# Altium project Y001_Artix7_USB3.0_D0.PrjPCB (part 2 of 2)

## Sheet POWER.SchDoc
size A3
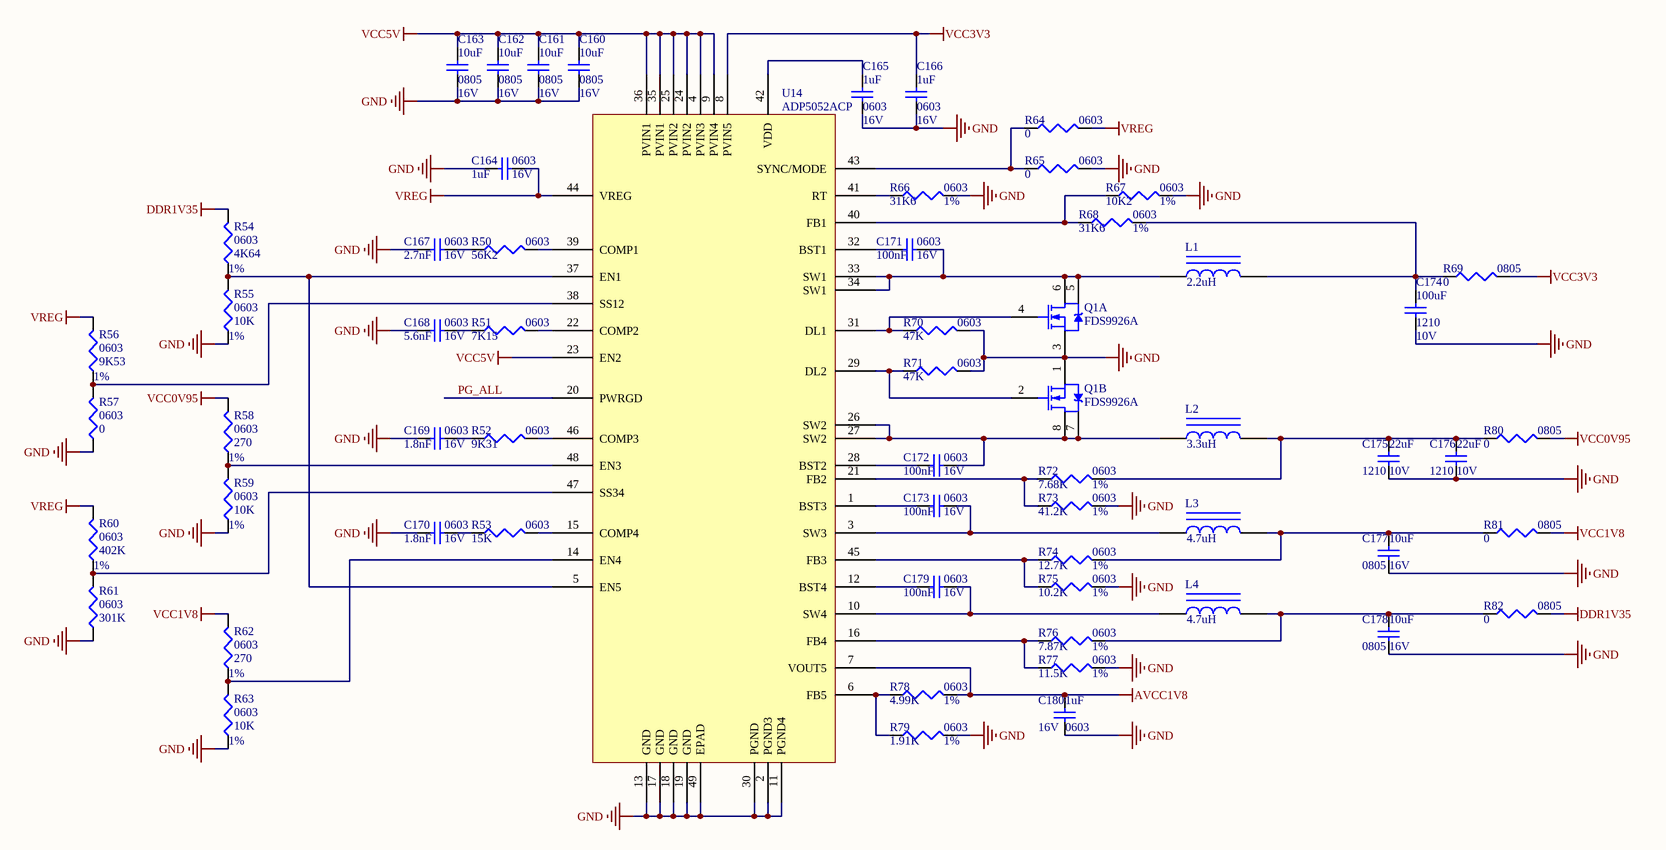
[diagram p7: POWER.SchDoc]

### Parts
C160  PackageReference: 0805  V: 16V  [2012[0805]]  (hidden comment: 10uF)
C161  PackageReference: 0805  V: 16V  [2012[0805]]  (hidden comment: 10uF)
C162  PackageReference: 0805  V: 16V  [2012[0805]]  (hidden comment: 10uF)
C163  PackageReference: 0805  V: 16V  [2012[0805]]  (hidden comment: 10uF)
C164  PackageReference: 0603  V: 16V  [1608[0603]]  (hidden comment: 1uF)
C165  PackageReference: 0603  V: 16V  [1608[0603]]  (hidden comment: 1uF)
C166  PackageReference: 0603  V: 16V  [1608[0603]]  (hidden comment: 1uF)
C167  PackageReference: 0603  V: 16V  [1608[0603]]  (hidden comment: 2.7nF)
C168  PackageReference: 0603  V: 16V  [1608[0603]]  (hidden comment: 5.6nF)
C169  PackageReference: 0603  V: 16V  [1608[0603]]  (hidden comment: 1.8nF)
C170  PackageReference: 0603  V: 16V  [1608[0603]]  (hidden comment: 1.8nF)
C171  PackageReference: 0603  V: 16V  [1608[0603]]  (hidden comment: 100nF)
C172  PackageReference: 0603  V: 16V  [1608[0603]]  (hidden comment: 100nF)
C173  PackageReference: 0603  V: 16V  [1608[0603]]  (hidden comment: 100nF)
C174  PackageReference: 1210  V: 10V  [2012[0805]]  (hidden comment: 100uF)
C175  PackageReference: 1210  V: 10V  [2012[0805]]  (hidden comment: 22uF)
C176  PackageReference: 1210  V: 10V  [2012[0805]]  (hidden comment: 22uF)
C177  PackageReference: 0805  V: 16V  [2012[0805]]  (hidden comment: 10uF)
C178  PackageReference: 0805  V: 16V  [2012[0805]]  (hidden comment: 10uF)
C179  PackageReference: 0603  V: 16V  [1608[0603]]  (hidden comment: 100nF)
C180  PackageReference: 0603  V: 16V  [1608[0603]]  (hidden comment: 1uF)
L1  value 2.2uH  [SRN6045]  (hidden comment: Inductor Iron)
L2  value 3.3uH  [SRN4018]  (hidden comment: Inductor Iron)
L3  value 4.7uH  [SRN4018]  (hidden comment: Inductor Iron)
L4  value 4.7uH  [SRN4018]  (hidden comment: Inductor Iron)
Q1  FDS9926A  [FDS9926A]  (parts A,B of 2)
R50  value 56K2  PackageReference: 0603  [1608[0603]]  (hidden comment: Res3)
R51  value 7K15  PackageReference: 0603  [1608[0603]]  (hidden comment: Res3)
R52  value 9K31  PackageReference: 0603  [1608[0603]]  (hidden comment: Res3)
R53  value 15K  PackageReference: 0603  [1608[0603]]  (hidden comment: Res3)
R54  value 4K64  PackageReference: 0603  AC: 1%  [1608[0603]]  (hidden comment: Res3)
R55  value 10K  PackageReference: 0603  AC: 1%  [1608[0603]]  (hidden comment: Res3)
R56  value 9K53  PackageReference: 0603  AC: 1%  [1608[0603]]  (hidden comment: Res3)
R57  value 0  PackageReference: 0603  [1608[0603]]  (hidden comment: Res3)
R58  value 270  PackageReference: 0603  AC: 1%  [1608[0603]]  (hidden comment: Res3)
R59  value 10K  PackageReference: 0603  AC: 1%  [1608[0603]]  (hidden comment: Res3)
R60  value 402K  PackageReference: 0603  AC: 1%  [1608[0603]]  (hidden comment: Res3)
R61  value 301K  PackageReference: 0603  [1608[0603]]  (hidden comment: Res3)
R62  value 270  PackageReference: 0603  AC: 1%  [1608[0603]]  (hidden comment: Res3)
R63  value 10K  PackageReference: 0603  AC: 1%  [1608[0603]]  (hidden comment: Res3)
R64  value 0  PackageReference: 0603  [1608[0603]]  (hidden comment: Res3)
R65  value 0  PackageReference: 0603  [1608[0603]]  (hidden comment: Res3)
R66  value 31K6  PackageReference: 0603  AC: 1%  [1608[0603]]  (hidden comment: Res3)
R67  value 10K2  PackageReference: 0603  AC: 1%  [1608[0603]]  (hidden comment: Res3)
R68  value 31K6  PackageReference: 0603  AC: 1%  [1608[0603]]  (hidden comment: Res3)
R69  value 0  PackageReference: 0805  [2012[0805]]  (hidden comment: Res3)
R70  value 47K  PackageReference: 0603  [1608[0603]]  (hidden comment: Res3)
R71  value 47K  PackageReference: 0603  [1608[0603]]  (hidden comment: Res3)
R72  value 7.68K  PackageReference: 0603  AC: 1%  [1608[0603]]  (hidden comment: Res3)
R73  value 41.2K  PackageReference: 0603  AC: 1%  [1608[0603]]  (hidden comment: Res3)
R74  value 12.7K  PackageReference: 0603  AC: 1%  [1608[0603]]  (hidden comment: Res3)
R75  value 10.2K  PackageReference: 0603  AC: 1%  [1608[0603]]  (hidden comment: Res3)
R76  value 7.87K  PackageReference: 0603  AC: 1%  [1608[0603]]  (hidden comment: Res3)
R77  value 11.5K  PackageReference: 0603  AC: 1%  [1608[0603]]  (hidden comment: Res3)
R78  value 4.99K  PackageReference: 0603  AC: 1%  [1608[0603]]  (hidden comment: Res3)
R79  value 1.91K  PackageReference: 0603  AC: 1%  [1608[0603]]  (hidden comment: Res3)
R80  value 0  PackageReference: 0805  [2012[0805]]  (hidden comment: Res3)
R81  value 0  PackageReference: 0805  [2012[0805]]  (hidden comment: Res3)
R82  value 0  PackageReference: 0805  [2012[0805]]  (hidden comment: Res3)
U14  ADP5052ACP  [ADP5052]

### Nets
AVCC1V8: C180.1 R78.2 U14.7(VOUT5)
DDR1V35: R54.2 R82.2
GND: C160.2 C161.2 C162.2 C163.2 C164.2 C165.2 C166.2 C167.2 C168.2 C169.2 C170.2 C174.1 C175.2 C176.2 C177.2 C178.2 C180.2 Q1.1(S) Q1.3(S) R55.1 R57.1 R59.1 R61.1 R63.1 R65.2 R66.2 R67.2 R70.2 R71.2 R73.2 R75.2 R77.2 R79.2 U14.2(PGND3) U14.11(PGND4) U14.13(GND) U14.17(GND) U14.18(GND) U14.19(GND) U14.30(PGND) U14.49(EPAD)
VCC0V95: R58.2 R80.2
VCC1V8: R62.2 R81.2
VCC3V3: C166.1 R69.2 U14.8(PVIN5)
VCC5V: C160.1 C161.1 C162.1 C163.1 U14.4(PVIN3) U14.9(PVIN4) U14.23(EN2) U14.24(PVIN2) U14.25(PVIN2) U14.35(PVIN1) U14.36(PVIN1)
VREG: C164.1 R56.2 R60.2 R64.2 U14.44(VREG)
PG_ALL: U14.20(PWRGD)
NetC165_1: C165.1 U14.42(VDD)
NetC167_1: C167.1 R50.1
NetC168_1: C168.1 R51.1
NetC169_1: C169.1 R52.1
NetC170_1: C170.1 R53.1
NetC171_1: C171.1 U14.32(BST1)
NetC171_2: C171.2 L1.1 Q1.5(D) Q1.6(D) U14.33(SW1) U14.34(SW1)
NetC172_1: C172.1 U14.28(BST2)
NetC172_2: C172.2 L2.1 Q1.7(D) Q1.8(D) U14.26(SW2) U14.27(SW2)
NetC173_1: C173.1 U14.1(BST3)
NetC173_2: C173.2 L3.1 U14.3(SW3)
NetC174_2: C174.2 L1.2 R68.2 R69.1
NetC175_1: C175.1 C176.1 L2.2 R72.2 R80.1
NetC177_1: C177.1 L3.2 R74.2 R81.1
NetC178_1: C178.1 L4.2 R76.2 R82.1
NetC179_1: C179.1 U14.12(BST4)
NetC179_2: C179.2 L4.1 U14.10(SW4)
NetQ1_2: Q1.2(G) R71.1 U14.29(DL2)
NetQ1_4: Q1.4(G) R70.1 U14.31(DL1)
NetR50_2: R50.2 U14.39(COMP1)
NetR51_2: R51.2 U14.22(COMP2)
NetR52_2: R52.2 U14.46(COMP3)
NetR53_2: R53.2 U14.15(COMP4)
NetR54_1: R54.1 R55.2 U14.5(EN5) U14.37(EN1)
NetR56_1: R56.1 R57.2 U14.38(SS12)
NetR58_1: R58.1 R59.2 U14.48(EN3)
NetR60_1: R60.1 R61.2 U14.47(SS34)
NetR62_1: R62.1 R63.2 U14.14(EN4)
NetR64_1: R64.1 R65.1 U14.43(SYNC/MODE)
NetR66_1: R66.1 U14.41(RT)
NetR67_1: R67.1 R68.1 U14.40(FB1)
NetR72_1: R72.1 R73.1 U14.21(FB2)
NetR74_1: R74.1 R75.1 U14.45(FB3)
NetR76_1: R76.1 R77.1 U14.16(FB4)
NetR78_1: R78.1 R79.1 U14.6(FB5)

### Library data of the parts
C160-C180 = Cap Semi: Capacitor (Semiconductor SIM Model); LatestRevisionDate: 17-Jul-2002; LatestRevisionNote: Re-released for DXP Platform.; Publisher: Altium Limited
  C160-C163 C177 C178: Value: 10uF
  C164-C166 C180: Value: 1uF
  C167: Value: 2.7nF
  C168: Value: 5.6nF
  C169 C170: Value: 1.8nF
  C171-C173 C179: Value: 100nF
  C174: Value: 100uF
  C175 C176: Value: 22uF
L1-L4 = Inductor Iron: Magnetic-Core Inductor; Published: 24-Mar-1999; LatestRevisionDate: 17-Jul-2002; LatestRevisionNote: Re-released for DXP Platform.; PackageReference: AXIAL-0.9; Publisher: Altium Limited
R50-R56 R58-R60 R62-R69 R72-R82 = Res3: Resistor; Published: 8-Jun-2000; LatestRevisionDate: 29-May-2009; LatestRevisionNote: IPC-7351 Footprint Added.; Publisher: Altium Limited; PackageDescription: Chip Resistor
R57 R61 R70 R71 = Res3: Resistor; AC: 1%; Published: 8-Jun-2000; LatestRevisionDate: 29-May-2009; LatestRevisionNote: IPC-7351 Footprint Added.; Publisher: Altium Limited; PackageDescription: Chip Resistor
U14 = ADP5052ACP\

## Sheet POWER2.SchDoc
size A3
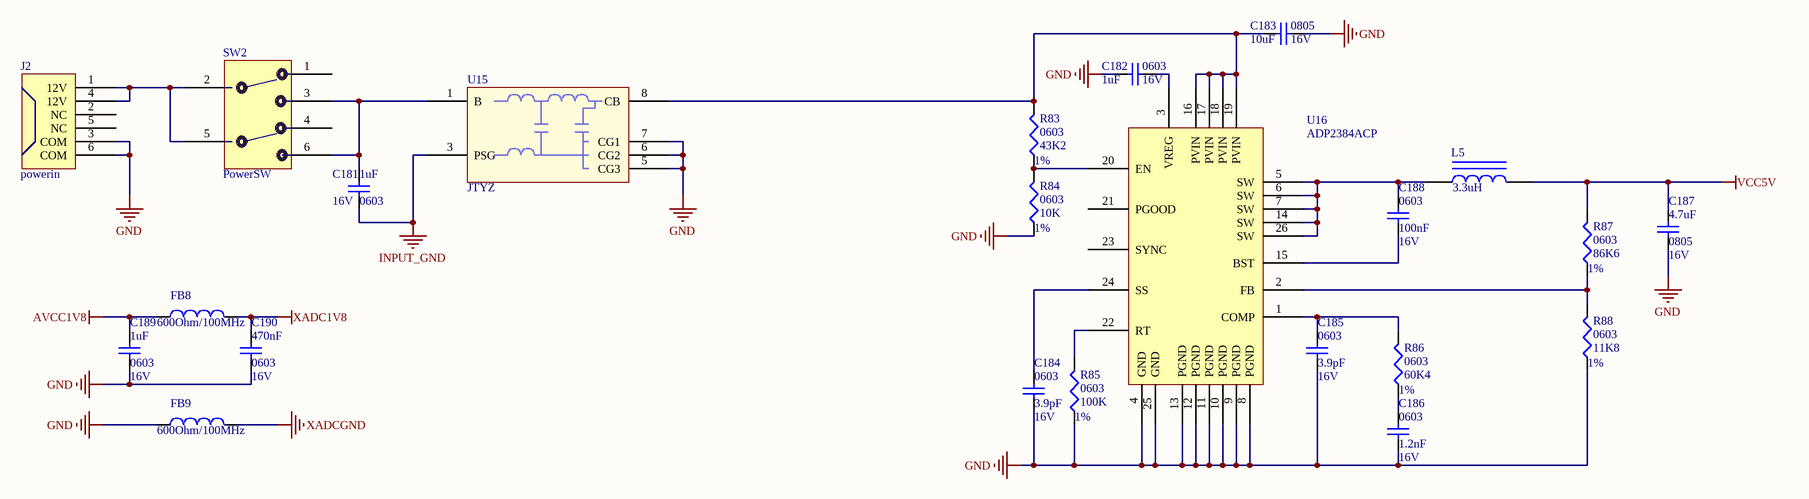
[diagram p8: POWER2.SchDoc]

### Parts
C181  PackageReference: 0603  V: 16V  [1608[0603]]  (hidden comment: 1uF)
C182  PackageReference: 0603  V: 16V  [1608[0603]]  (hidden comment: 1uF)
C183  PackageReference: 0805  V: 16V  [2012[0805]]  (hidden comment: 10uF)
C184  PackageReference: 0603  V: 16V  [1608[0603]]  (hidden comment: 3.9pF)
C185  PackageReference: 0603  V: 16V  [1608[0603]]  (hidden comment: 3.9pF)
C186  PackageReference: 0603  V: 16V  [1608[0603]]  (hidden comment: 1.2nF)
C187  PackageReference: 0805  V: 16V  [2012[0805]]  (hidden comment: 4.7uF)
C188  PackageReference: 0603  V: 16V  [1608[0603]]  (hidden comment: 100nF)
C189  PackageReference: 0603  V: 16V  [1608[0603]]  (hidden comment: 1uF)
C190  PackageReference: 0603  V: 16V  [1608[0603]]  (hidden comment: 470nF)
FB8  600Ohm/100MHz  [2012[0805]]
FB9  600Ohm/100MHz  [2012[0805]]
J2  powerin  [POWER2X3]
L5  value 3.3uH  [SRN4018]  (hidden comment: Inductor Iron)
R83  value 43K2  PackageReference: 0603  AC: 1%  [1608[0603]]  (hidden comment: Res3)
R84  value 10K  PackageReference: 0603  AC: 1%  [1608[0603]]  (hidden comment: Res3)
R85  value 100K  PackageReference: 0603  AC: 1%  [1608[0603]]  (hidden comment: Res3)
R86  value 60K4  PackageReference: 0603  AC: 1%  [1608[0603]]  (hidden comment: Res3)
R87  value 86K6  PackageReference: 0603  AC: 1%  [1608[0603]]  (hidden comment: Res3)
R88  value 11K8  PackageReference: 0603  AC: 1%  [1608[0603]]  (hidden comment: Res3)
SW2  PowerSW  [Power_SW]
U15  JTYZ  [JTYZ]
U16  ADP2384ACP  [ADP2384]

### Nets
AVCC1V8: C189.1 FB8.1
GND: C182.2 C183.2 C184.1 C185.1 C186.1 C187.2 C189.2 C190.2 FB9.1 J2.3(COM) J2.6(COM) R84.1 R85.1 R88.1 U15.5(CG3) U15.6(CG2) U15.7(CG1) U16.4(GND) U16.8(PGND) U16.9(PGND) U16.10(PGND) U16.11(PGND) U16.12(PGND) U16.13(PGND) U16.25(GND)
INPUT_GND: C181.2 U15.3(PSG)
VCC5V: C187.1 L5.2 R87.2
XADC1V8: C190.1 FB8.2
XADCGND: FB9.2
NetC181_1: C181.1 SW2.3 SW2.6 U15.1(B)
NetC182_1: C182.1 U16.3(VREG)
NetC183_1: C183.1 R83.2 U15.8(CB) U16.16(PVIN) U16.17(PVIN) U16.18(PVIN) U16.19(PVIN)
NetC184_2: C184.2 U16.24(SS)
NetC185_2: C185.2 R86.2 U16.1(COMP)
NetC186_2: C186.2 R86.1
NetC188_1: C188.1 U16.15(BST)
NetC188_2: C188.2 L5.1 U16.5(SW) U16.6(SW) U16.7(SW) U16.14(SW) U16.26(SW)
NetJ2_1: J2.1(12V) J2.4(12V) SW2.2 SW2.5
NetR83_1: R83.1 R84.2 U16.20(EN)
NetR85_2: R85.2 U16.22(RT)
NetR87_1: R87.1 R88.2 U16.2(FB)

Not connected (* = marked no-connect by the designer): J2 2(NC) 5(NC); SW2 1 4; U16 21(PGOOD) 23(SYNC)

### Library data of the parts
C181-C190 = Cap Semi: Capacitor (Semiconductor SIM Model); LatestRevisionDate: 17-Jul-2002; LatestRevisionNote: Re-released for DXP Platform.; Publisher: Altium Limited
  C181 C182 C189: Value: 1uF
  C183: Value: 10uF
  C184 C185: Value: 3.9pF
  C186: Value: 1.2nF
  C187: Value: 4.7uF
  C188: Value: 100nF
  C190: Value: 470nF
FB8 FB9 = Inductor: Value: 600Ohm/100MHz
L5 = Inductor Iron: Magnetic-Core Inductor; Published: 24-Mar-1999; LatestRevisionDate: 17-Jul-2002; LatestRevisionNote: Re-released for DXP Platform.; PackageReference: AXIAL-0.9; Publisher: Altium Limited
R83-R88 = Res3: Resistor; Published: 8-Jun-2000; LatestRevisionDate: 29-May-2009; LatestRevisionNote: IPC-7351 Footprint Added.; Publisher: Altium Limited; PackageDescription: Chip Resistor

## Nets that join several sheets
AVCC1V8: POWER (C180.1 R78.2 U14.7), POWER2 (C189.1 FB8.1)
DDR1V35: FPGA_Bank_3 (19 pins), DDR3 (39 pins), POWER (R54.2 R82.2)
GND: FPGA_Bank_1 (12 pins), FPGA_Bank_2 (14 pins), FPGA_Bank_3 (116 pins), FPGA_10_100 Ethernet PHY (23 pins), DDR3 (45 pins), USB3.0 (76 pins), POWER (41 pins), POWER2 (25 pins)
VCC0V95: FPGA_Bank_3 (31 pins), POWER (R58.2 R80.2)
VCC1V8: FPGA_Bank_3 (13 pins), USB3.0 (27 pins), POWER (R62.2 R81.2)
VCC3V3: FPGA_Bank_3 (53 pins), FPGA_10_100 Ethernet PHY (11 pins), POWER (C166.1 R69.2 U14.8)
VCC5V: POWER (11 pins), POWER2 (C187.1 L5.2 R87.2)
XADC1V8: FPGA_Bank_3 (C93.1 C94.1 U3.H10), POWER2 (C190.1 FB8.2)
XADCGND: FPGA_Bank_3 (C93.2 C94.2 U3.H9), POWER2 (FB9.2)
CTL0: FPGA_Bank_1 (U3.C1), USB3.0 (U10.K8)
CTL1: FPGA_Bank_1 (U3.H1), USB3.0 (U10.K7)
CTL2: FPGA_Bank_1 (U3.G1), USB3.0 (U10.J7)
CTL3: FPGA_Bank_1 (U3.F1), USB3.0 (U10.H7)
CTL4: FPGA_Bank_1 (U3.E1), USB3.0 (U10.G7)
CTL5: FPGA_Bank_1 (U3.G6), USB3.0 (U10.G6)
CTL6: FPGA_Bank_1 (U3.F6), USB3.0 (U10.K6)
CTL7: FPGA_Bank_1 (U3.G4), USB3.0 (U10.H8)
CTL8: FPGA_Bank_1 (U3.G3), USB3.0 (U10.G5)
CTL9: FPGA_Bank_1 (U3.J4), USB3.0 (U10.H6)
CTL10: FPGA_Bank_1 (U3.H4), USB3.0 (U10.K5)
CTL11: FPGA_Bank_1 (U3.J3), USB3.0 (U10.J5)
CTL12: FPGA_Bank_1 (U3.J2), USB3.0 (U10.H5)
DDR3_A0: FPGA_Bank_0 (U3.G14), DDR3 (U1.N3)
DDR3_A1: FPGA_Bank_0 (U3.H17), DDR3 (U1.P7)
DDR3_A2: FPGA_Bank_0 (U3.D17), DDR3 (U1.P3)
DDR3_A3: FPGA_Bank_0 (U3.J13), DDR3 (U1.N2)
DDR3_A4: FPGA_Bank_0 (U3.G17), DDR3 (U1.P8)
DDR3_A5: FPGA_Bank_0 (U3.J17), DDR3 (U1.P2)
DDR3_A6: FPGA_Bank_0 (U3.C17), DDR3 (U1.R8)
DDR3_A7: FPGA_Bank_0 (U3.G18), DDR3 (U1.R2)
DDR3_A8: FPGA_Bank_0 (U3.K15), DDR3 (U1.T8)
DDR3_A9: FPGA_Bank_0 (U3.C16), DDR3 (U1.R3)
DDR3_A10: FPGA_Bank_0 (U3.J14), DDR3 (U1.L7)
DDR3_A11: FPGA_Bank_0 (U3.F18), DDR3 (U1.R7)
DDR3_A12: FPGA_Bank_0 (U3.J18), DDR3 (U1.N7)
DDR3_A13: FPGA_Bank_0 (U3.J15), DDR3 (U1.T3)
DDR3_BA0: FPGA_Bank_0 (U3.K13), DDR3 (U1.M2)
DDR3_BA1: FPGA_Bank_0 (U3.F15), DDR3 (U1.N8)
DDR3_BA2: FPGA_Bank_0 (U3.H14), DDR3 (U1.M3)
DDR3_CAS: FPGA_Bank_0 (U3.E17), DDR3 (U1.K3)
DDR3_CKE0: FPGA_Bank_0 (U3.H16), DDR3 (U1.K9)
DDR3_CLK0_N: FPGA_Bank_0 (U3.D18), DDR3 (R3.2 U1.K7)
DDR3_CLK0_P: FPGA_Bank_0 (U3.E18), DDR3 (R3.1 U1.J7)
DDR3_CS: FPGA_Bank_0 (U3.K16), DDR3 (U1.L2)
DDR3_DM0: FPGA_Bank_0 (U3.D14), DDR3 (U1.E7)
DDR3_DM1: FPGA_Bank_0 (U3.B16), DDR3 (U1.D3)
DDR3_DQ0: FPGA_Bank_0 (U3.F13), DDR3 (U1.E3)
DDR3_DQ1: FPGA_Bank_0 (U3.B14), DDR3 (U1.F7)
DDR3_DQ2: FPGA_Bank_0 (U3.B13), DDR3 (U1.F2)
DDR3_DQ3: FPGA_Bank_0 (U3.D12), DDR3 (U1.F8)
DDR3_DQ4: FPGA_Bank_0 (U3.B11), DDR3 (U1.H3)
DDR3_DQ5: FPGA_Bank_0 (U3.C14), DDR3 (U1.H8)
DDR3_DQ6: FPGA_Bank_0 (U3.F14), DDR3 (U1.G2)
DDR3_DQ7: FPGA_Bank_0 (U3.A11), DDR3 (U1.H7)
DDR3_DQ8: FPGA_Bank_0 (U3.A18), DDR3 (U1.D7)
DDR3_DQ9: FPGA_Bank_0 (U3.D15), DDR3 (U1.C3)
DDR3_DQ10: FPGA_Bank_0 (U3.A15), DDR3 (U1.C8)
DDR3_DQ11: FPGA_Bank_0 (U3.B18), DDR3 (U1.C2)
DDR3_DQ12: FPGA_Bank_0 (U3.B17), DDR3 (U1.A7)
DDR3_DQ13: FPGA_Bank_0 (U3.E16), DDR3 (U1.A2)
DDR3_DQ14: FPGA_Bank_0 (U3.A16), DDR3 (U1.B8)
DDR3_DQ15: FPGA_Bank_0 (U3.E15), DDR3 (U1.A3)
DDR3_DQS0_N: FPGA_Bank_0 (U3.B12), DDR3 (U1.G3)
DDR3_DQS0_P: FPGA_Bank_0 (U3.C12), DDR3 (U1.F3)
DDR3_DQS1_N: FPGA_Bank_0 (U3.A14), DDR3 (U1.B7)
DDR3_DQS1_P: FPGA_Bank_0 (U3.A13), DDR3 (U1.C7)
DDR3_ODT: FPGA_Bank_0 (U3.H15), DDR3 (U1.K1)
DDR3_RAS: FPGA_Bank_0 (U3.F16), DDR3 (U1.J3)
DDR3_RESET: FPGA_Bank_0 (U3.G13), DDR3 (R4.1 U1.T2)
DDR3_WE: FPGA_Bank_0 (U3.G16), DDR3 (U1.L3)
DQ0: FPGA_Bank_1 (U3.F5), USB3.0 (U10.F10)
DQ1: FPGA_Bank_1 (U3.C6), USB3.0 (U10.F9)
DQ2: FPGA_Bank_1 (U3.C5), USB3.0 (U10.F7)
DQ3: FPGA_Bank_1 (U3.B7), USB3.0 (U10.G10)
DQ4: FPGA_Bank_1 (U3.B6), USB3.0 (U10.G9)
DQ5: FPGA_Bank_1 (U3.A6), USB3.0 (U10.F8)
DQ6: FPGA_Bank_1 (U3.A5), USB3.0 (U10.H10)
DQ7: FPGA_Bank_1 (U3.D8), USB3.0 (U10.H9)
DQ8: FPGA_Bank_1 (U3.C7), USB3.0 (U10.J10)
DQ9: FPGA_Bank_1 (U3.E6), USB3.0 (U10.J9)
DQ10: FPGA_Bank_1 (U3.E5), USB3.0 (U10.K11)
DQ11: FPGA_Bank_1 (U3.E7), USB3.0 (U10.L10)
DQ12: FPGA_Bank_1 (U3.D7), USB3.0 (U10.K10)
DQ13: FPGA_Bank_1 (U3.C4), USB3.0 (U10.K9)
DQ14: FPGA_Bank_1 (U3.B4), USB3.0 (U10.J8)
DQ15: FPGA_Bank_1 (U3.A4), USB3.0 (U10.G8)
DQ16: FPGA_Bank_1 (U3.A3), USB3.0 (U10.K2)
DQ17: FPGA_Bank_1 (U3.B1), USB3.0 (U10.J4)
DQ18: FPGA_Bank_1 (U3.A1), USB3.0 (U10.K1)
DQ19: FPGA_Bank_1 (U3.B3), USB3.0 (U10.J2)
DQ20: FPGA_Bank_1 (U3.B2), USB3.0 (U10.J3)
DQ21: FPGA_Bank_1 (U3.D5), USB3.0 (U10.J1)
DQ22: FPGA_Bank_1 (U3.D4), USB3.0 (U10.H2)
DQ23: FPGA_Bank_1 (U3.E3), USB3.0 (U10.H3)
DQ24: FPGA_Bank_1 (U3.D3), USB3.0 (U10.F4)
DQ25: FPGA_Bank_1 (U3.F4), USB3.0 (U10.G2)
DQ26: FPGA_Bank_1 (U3.F3), USB3.0 (U10.G3)
DQ27: FPGA_Bank_1 (U3.E2), USB3.0 (U10.F3)
DQ28: FPGA_Bank_1 (U3.D2), USB3.0 (U10.F5)
DQ29: FPGA_Bank_1 (U3.H2), USB3.0 (U10.E1)
DQ30: FPGA_Bank_1 (U3.G2), USB3.0 (U10.E5)
DQ31: FPGA_Bank_1 (U3.C2), USB3.0 (U10.E4)
ETH_COL: FPGA_Bank_0 (U3.U2), FPGA_10_100 Ethernet PHY (R12.2 U2.35)
ETH_CRS: FPGA_Bank_0 (U3.V2), FPGA_10_100 Ethernet PHY (R11.2 U2.33)
ETH_MDC: FPGA_Bank_0 (U3.R3), FPGA_10_100 Ethernet PHY (U2.25)
ETH_MDIO: FPGA_Bank_0 (U3.V4), FPGA_10_100 Ethernet PHY (R10.2 U2.24)
ETH_RX_CLK: FPGA_Bank_0 (U3.U4), FPGA_10_100 Ethernet PHY (U2.31)
ETH_RX_DV: FPGA_Bank_0 (U3.V1), FPGA_10_100 Ethernet PHY (U2.32)
ETH_RXD0: FPGA_Bank_0 (U3.M2), FPGA_10_100 Ethernet PHY (R15.2 U2.36)
ETH_RXD1: FPGA_Bank_0 (U3.K5), FPGA_10_100 Ethernet PHY (R14.2 U2.37)
ETH_RXD2: FPGA_Bank_0 (U3.L4), FPGA_10_100 Ethernet PHY (U2.38)
ETH_RXD3: FPGA_Bank_0 (U3.L6), FPGA_10_100 Ethernet PHY (U2.39)
ETH_RXERR: FPGA_Bank_0 (U3.U1), FPGA_10_100 Ethernet PHY (R13.2 U2.34)
ETH_TX_CLK: FPGA_Bank_0 (U3.N1), FPGA_10_100 Ethernet PHY (U2.2)
ETH_TX_EN: FPGA_Bank_0 (U3.N2), FPGA_10_100 Ethernet PHY (U2.3)
ETH_TXD0: FPGA_Bank_0 (U3.K6), FPGA_10_100 Ethernet PHY (U2.4)
ETH_TXD1: FPGA_Bank_0 (U3.L1), FPGA_10_100 Ethernet PHY (U2.5)
ETH_TXD2: FPGA_Bank_0 (U3.M1), FPGA_10_100 Ethernet PHY (U2.6)
ETH_TXD3: FPGA_Bank_0 (U3.K3), FPGA_10_100 Ethernet PHY (U2.7)
IF_INT: FPGA_Bank_1 (U3.K1), USB3.0 (U10.L8)
IF_PCLK: FPGA_Bank_1 (U3.K2), USB3.0 (U10.J6)
RESET_USB: FPGA_Bank_1 (U3.H6), USB3.0 (C135.1 R38.1 S1.1 U10.C5)